# EasyEDA Pro project ProPrj_BeaconOps.epro

# Schematic Schematic
Board Name: Board1; Create Date: 2026-05-24; Page Name: P1; Project Name: BeaconOps; Schematic Name: Schematic; Update Date: 2026-05-24
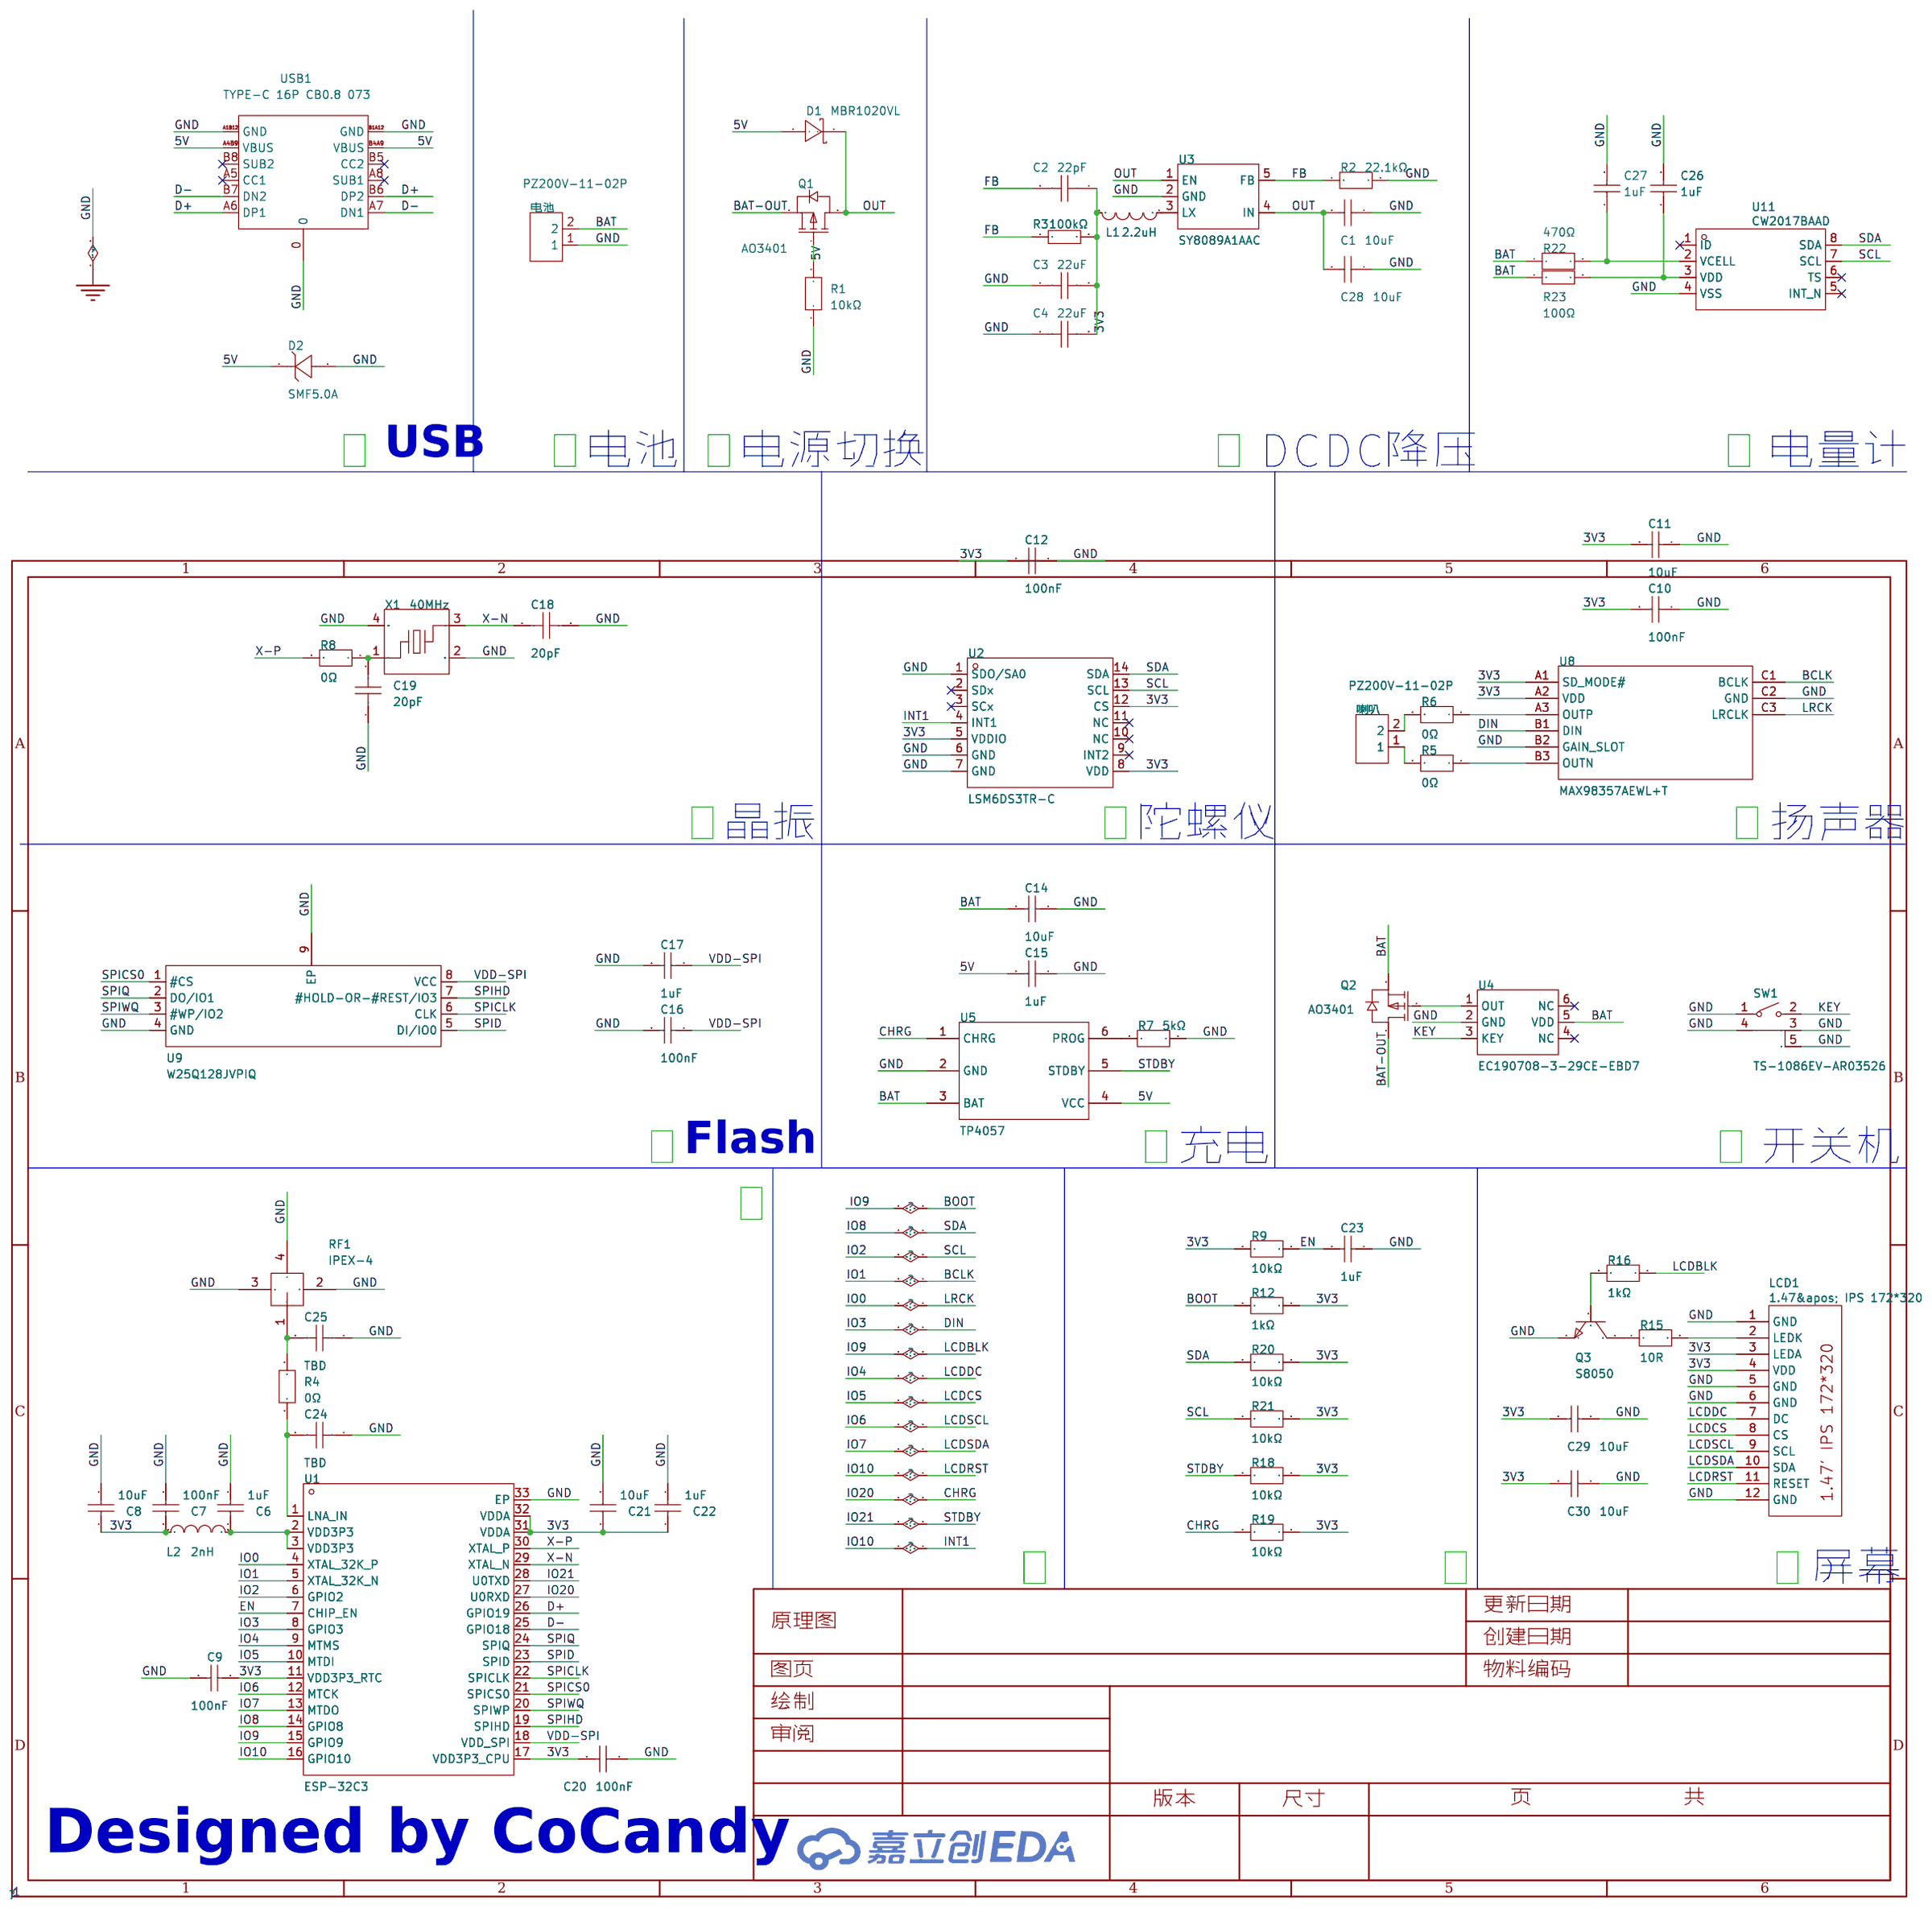
[diagram p0: schematic sheet]

## Parts
C1  10uF  [R0402]
C2  22pF  [R0402]
C3  22uF  [R0402]
C4  22uF  [R0402]
C6  1uF  [R0402]
C7  100nF  [R0402]
C8  10uF  [R0402]
C9  100nF  [R0402]
C10  100nF  [R0402]
C11  10uF  [R0402]
C12  100nF  [R0402]
C14  10uF  [R0402]
C15  1uF  [R0402]
C16  100nF  [R0402]
C17  1uF  [R0402]
C18  20pF  [R0402]
C19  20pF  [R0402]
C20  100nF  [R0402]
C21  10uF  [R0402]
C22  1uF  [R0402]
C23  1uF  [R0402]
C24  20pF  [R0402]
C25  20pF  [R0402]
C26  1uF  [R0402]
C27  1uF  [R0402]
C28  10uF  [R0402]
C29  10uF  [R0402]
C30  10uF  [R0402]
D1  MBR1020VL  [SOD-123F_L2.8-W1.8-LS3.7-RD]
D2  SMF5.0A  [SOD-123FL_L2.7-W1.8-LS3.8-RD]
L1  2.2uH  [IND-SMD_L4.4-W4.2]
L2  2nH  [R0402]
LCD1  1.47&apos; IPS 172*320  [1.47寸 IPS 172*320]
Q1  AO3401  [SOT-23-3_L2.9-W1.4-P1.90-LS2.6-BR]
Q2  AO3401  [SOT-23-3_L2.9-W1.4-P1.90-LS2.6-BR]
Q3  S8050  [SOT-23-3_L2.9-W1.3-P1.90-LS2.4-BR]
R1  10kΩ  [R0402]
R2  22.1kΩ  [R0402]
R3  100kΩ  [R0402]
R4  0Ω  [R0402]
R5  0Ω  [R0402]
R6  0Ω  [R0402]
R7  5kΩ  [R0402]
R8  0Ω  [R0402]
R9  10kΩ  [R0402]
R12  1kΩ  [R0402]
R15  10R  [R0402]
R16  1kΩ  [R0402]
R18  10kΩ  [R0402]
R19  10kΩ  [R0402]
R20  10kΩ  [R0402]
R21  10kΩ  [R0402]
R22  470Ω  [R0402]
R23  100Ω  [R0402]
RF1  IPEX-4  [IPEX-SMD_4P-L1.8-W1.7-LS2.0]
SW1  TS-1086EV-AR03526  [SW-SMD_TS-1086EV-AR03526]
U1  ESP-32C3  [QFN-32_L5.0-W5.0-P0.50-TL-EP3.7]
U2  LSM6DS3TR-C  [LGA-14_L3.0-W2.5-P0.50-TL]
U3  SY8089A1AAC  [TSOT-23-5_L2.9-W1.6-P0.95-LS2.8-BR]
U4  EC190708-3-29CE-EBD7  [SOT-23-6_L2.9-W1.6-P0.95-LS2.9-BL]
U5  TP4057  [SOT-23-6_L2.9-W1.6-P0.95-LS2.8-BR]
U8  MAX98357AEWL+T  [WLP-9_L1.4-W1.3-P0.40-R3-C3-BR]
U9  W25Q128JVPIQ  [WSON-8_L6.0-W5.0-P1.27-BL-EP]
U11  CW2017BAAD  [WDFN-8_L2.0-W2.0-P0.50-BL]
USB1  TYPE-C 16P CB0.8 073  [USB-C-SMD_TYPE-C-16P-CB0.8-073]
X1  40MHz  [CRYSTAL-SMD_4P-L2.0-W1.6-BL-2]
喇叭  PZ200V-11-02P  [HDR-TH_2P-P2.00-V-M]
电池  PZ200V-11-02P  [HDR-TH_2P-P2.00-V-M]

## Library data of the parts
C1 C8 C11 C14 C21 C28-C30 = CL05A106MQ5NUNC: 容值:10uF;精度:±20%;额定电压:6.3V;材质(温度系数):X5R;; LCSC Part Name: 10uF ±20% 6.3V; Supplier Part: C15525; Manufacturer: SAMSUNG(三星); Supplier Footprint: 0402; JLCPCB Part Class: 基础库; Datasheet: https://atta.szlcsc.com/upload/public/pdf/source/20220823/2B02EE04F8F211D38A52DCB16EB6BEBA.pdf; Supplier: LCSC; Tolerance: ±20%; Voltage Rated: 6.3V; Temperature Coefficient: X5R
C2 = RF03N220J250CT: 容值:22pF;精度:±5%;额定电压:25V;材质(温度系数):NP0;; LCSC Part Name: 22pF ±5% 25V; Supplier Part: C304672; Manufacturer: Walsin(华新科); Supplier Footprint: 0201; JLCPCB Part Class: 扩展库; Datasheet: https://atta.szlcsc.com/upload/public/pdf/source/20191217/C469622_E5C675410661E206E30F3A5ADE7C582C.pdf; Supplier: LCSC; Tolerance: ±5%; Voltage Rated: 25V; Temperature Coefficient: NP0
C3 C4 = GRM155R60J226ME11D: 容值:22uF;精度:±20%;额定电压:6.3V;温度系数:X5R;; LCSC Part Name: 22uF ±20% 6.3V; Supplier Part: C415703; Manufacturer: muRata(村田); Supplier Footprint: 0402; JLCPCB Part Class: 扩展库; Datasheet: https://atta.szlcsc.com/upload/public/pdf/source/20200305/C490387_23319AE8C154DEB24C505E6C82A8106A.pdf; Supplier: LCSC; Tolerance: ±20%; Voltage Rating: 6.3V; Temperature Coefficient: X5R
C6 C15 C17 C22 C23 = GRM033R61A105ME44D: 容值:1uF;精度:±20%;额定电压:10V;材质(温度系数):X5R;; LCSC Part Name: 1uF ±20% 10V; Supplier Part: C76935; Manufacturer: muRata(村田); Supplier Footprint: 0201; JLCPCB Part Class: 扩展库; Datasheet: https://atta.szlcsc.com/upload/public/pdf/source/20190904/C426118_85E81C7C1F21FC87C5FB6D536E0847B4.pdf; Supplier: LCSC; Tolerance: ±20%; Voltage Rated: 10V; Temperature Coefficient: X5R
C7 C9 C10 C12 C16 C20 C26 C27 = GRM033R61E104KE14D: 容值:100nF;精度:±10%;额定电压:25V;温度系数:X5R;; LCSC Part Name: 100nF ±10% 25V; Supplier Part: C76939; Manufacturer: muRata(村田); Supplier Footprint: 0201; JLCPCB Part Class: 扩展库; Datasheet: https://atta.szlcsc.com/upload/public/pdf/source/20180307/C76939_15204091018551407727.pdf; Supplier: LCSC; Tolerance: ±10%; Voltage Rating: 25V; Temperature Coefficient: X5R
C18 C19 C24 C25 = CGA0201C0G200J500ET: 容值:20pF;精度:±5%;额定电压:50V;温度系数:C0G;; LCSC Part Name: 20pF ±5% 50V; Supplier Part: C22435933; Manufacturer: HRE(芯声); Supplier Footprint: 0201; JLCPCB Part Class: 扩展库; Datasheet: https://atta.szlcsc.com/upload/public/pdf/source/20240523/E378902E5B8392A09BB57539773628DB.pdf; Supplier: LCSC; Tolerance: ±5%; Voltage Rating: 50V; Temperature Coefficient: C0G
D1 = MBR1020VL: Supplier: LCSC; Supplier Part: C191986; Manufacturer: onsemi(安森美); JLCPCB Part Class: Extended Part
D2 = SMF5.0A_C19077497: 极性:单向;反向截止电压(Vrwm):5V;钳位电压:9.2V;峰值脉冲电流(Ipp):21.7A@10/1000us;峰值脉冲功率(Ppp):200W@10/1000us;击穿电压:7V;; LCSC Part Name: 单向TVS 5V截止 峰值浪涌电流：21.7A@10/1000us; Supplier Part: C19077497; Manufacturer: R+O(宏嘉诚); Supplier Footprint: SOD-123FL; JLCPCB Part Class: 扩展库; Datasheet: https://item.szlcsc.com/datasheet/SMF5.0A/20275582.html; Supplier: LCSC; Polarity: 单向; Reverse Stand-Off Voltage (Vrwm): 5V; Clamping Voltage: 9.2V; Peak Pulse Current (Ipp): 21.7A@10/1000us; Peak Pulse Power Dissipation (Ppp): 200W@10/1000us; Voltage - Breakdown: 7V; Reverse Leakage Current (Ir): 400uA; Number of Channels: 单路; Operating Temperature: -55℃~+150℃; level of protection: IEC 61000-4-2; Type: TVS
L1 = FXL0420-2R2-M: 电感值:2.2uH;精度:±20%;额定电流:4.5A;饱和电流(Isat):5A;类型:一体成型电感;; LCSC Part Name: 2.2uH ±20% 5A; Supplier Part: C167206; Manufacturer: cjiang(长江微电); Supplier Footprint: SMD,4.2x4.4mm; JLCPCB Part Class: 扩展库; Datasheet: https://atta.szlcsc.com/upload/public/pdf/source/20240426/3189EA8206330E2108542F9E34E540E7.pdf; Supplier: LCSC; Tolerance: ±20%; Rated Current: 4.5A; Saturation Current (Isat): 5A; DC Resistance (DCR): 58mΩ; Type: 一体成型电感
L2 = LQP03TN2N0B02D: 电感值:2nH;精度:-;额定电流:600mA;饱和电流(Isat):-;直流电阻(DCR):150mΩ;; LCSC Part Name: 2nH ±0.1nH; Supplier Part: C86125; Manufacturer: muRata(村田); Supplier Footprint: 0201; JLCPCB Part Class: 扩展库; Datasheet: https://atta.szlcsc.com/upload/public/pdf/source/20200107/C157592_7FF58F85BAEF0D918ADFA12AEC0AEBA8.pdf; Supplier: LCSC; Rated Current: 600mA; DC Resistance (DCR): 150mΩ; Q @ Freq: 14@500MHz; Frequency - Self Resonant: 12.5GHz
LCD1 = 1.47' IPS 172*320
Q1 Q2 = AO3401_C727156: 类型:1个P沟道;漏源电压(Vdss):30V;连续漏极电流(Id):4.2A;导通电阻(RDS(on)@Vgs,Id):65mΩ@10V,4.2A;功率:350mW;阈值电压(Vgs(th)@Id):1.3V@250uA;; LCSC Part Name: 1个P沟道 耐压:30V 电流:4.2A; Supplier Part: C727156; Manufacturer: TWGMC(台湾迪嘉); Supplier Footprint: SOT-23; JLCPCB Part Class: 扩展库; Datasheet: https://atta.szlcsc.com/upload/public/pdf/source/20200827/C727156_6E081BBEEFBC6B8FEE164CB196B0AF30.pdf; Supplier: LCSC; Type: 1个P沟道; Drain Source Voltage (Vdss): 30V; Continuous Drain Current (Id): 4.2A; Drain Source On Resistance (RDS(on)@Vgs,Id): 65mΩ@10V,4.2A; Power Dissipation (Pd): 350mW; Gate Threshold Voltage (Vgs(th)@Id): 1.3V@250uA; Input Capacitance (Ciss@Vds): 954pF; Reverse Transfer Capacitance (Crss@Vds): 77pF; Operating Temperature: -55℃~+150℃
Q3 = S8050_C2891804: 晶体管类型:NPN;集电极电流(Ic):500mA;集射极击穿电压(Vceo):25V;耗散功率(Pd):300mW;直流电流增益(hFE):400@50mA,1V;; Supplier Part: C2891804; Manufacturer: YONGYUTAI(永裕泰); Supplier Footprint: SOT-23; JLCPCB Part Class: 扩展库; Datasheet: https://atta.szlcsc.com/upload/public/pdf/source/20210901/5347316A10609C628D4D69AE01446E5B.pdf; Supplier: LCSC; type: NPN; Current - Collector(Ic): 500mA; Collector - Emitter Voltage VCEO: 25V; Pd - Power Dissipation: 300mW; DC Current Gain: 400@50mA,1V; Current - Collector Cutoff: 1uA; Vce Saturation(VCE(sat)): 500mV
R1 R9 R12 R16 R18-R21 = 0201WMF1002TEE: 电阻类型:厚膜电阻;阻值:10kΩ;精度:±1%;功率:50mW;最大工作电压:25V;温度系数:±200ppm/℃;; LCSC Part Name: 10kΩ ±1% 50mW 厚膜电阻; Supplier Part: C473048; Manufacturer: UNI-ROYAL(厚声); Supplier Footprint: 0201; JLCPCB Part Class: 扩展库; Datasheet: https://atta.szlcsc.com/upload/public/pdf/source/20200306/C422600_1E6D84923E4A46A82E41ADD87F860B5C.pdf; Supplier: LCSC; Type: 厚膜电阻; Tolerance: ±1%; Power(Watts): 50mW; Overload Voltage (Max): 25V; Temperature Coefficient: ±200ppm/℃; Operating Temperature Range: -55℃~+155℃
R2 = 0201WMF2212TEE: 电阻类型:厚膜电阻;阻值:22.1kΩ;精度:±1%;功率:50mW;最大工作电压:25V;温度系数:±200ppm/℃;; LCSC Part Name: 22.1kΩ ±1% 50mW 厚膜电阻; Supplier Part: C423662; Manufacturer: UNI-ROYAL(厚声); Supplier Footprint: 0201; JLCPCB Part Class: 扩展库; Datasheet: https://atta.szlcsc.com/upload/public/pdf/source/20200306/C422600_1E6D84923E4A46A82E41ADD87F860B5C.pdf; Supplier: LCSC; Type: 厚膜电阻; Tolerance: ±1%; Power(Watts): 50mW; Overload Voltage (Max): 25V; Temperature Coefficient: ±200ppm/℃; Operating Temperature Range: -55℃~+155℃
R3 = 0201WMF1003TEE: 电阻类型:厚膜电阻;阻值:100kΩ;精度:±1%;功率:50mW;最大工作电压:25V;温度系数:±200ppm/℃;; LCSC Part Name: 100kΩ ±1% 50mW 厚膜电阻; Supplier Part: C270364; Manufacturer: UNI-ROYAL(厚声); Supplier Footprint: 0201; JLCPCB Part Class: 扩展库; Datasheet: https://atta.szlcsc.com/upload/public/pdf/source/20200306/C422600_1E6D84923E4A46A82E41ADD87F860B5C.pdf; Supplier: LCSC; Type: 厚膜电阻; Tolerance: ±1%; Power(Watts): 50mW; Overload Voltage (Max): 25V; Temperature Coefficient: ±200ppm/℃; Operating Temperature Range: -55℃~+155℃
R4-R6 R8 = 0201WMF0000TEE: 电阻类型:厚膜电阻;阻值:0Ω;精度:±1%;功率:50mW;最大工作电压:25V;; LCSC Part Name: 0Ω ±1% 50mW 厚膜电阻; Supplier Part: C473473; Manufacturer: UNI-ROYAL(厚声); Supplier Footprint: 0201; JLCPCB Part Class: 扩展库; Datasheet: https://atta.szlcsc.com/upload/public/pdf/source/20200306/C422600_1E6D84923E4A46A82E41ADD87F860B5C.pdf; Supplier: LCSC; Type: 厚膜电阻; Tolerance: ±1%; Power(Watts): 50mW; Overload Voltage (Max): 25V; Operating Temperature Range: -55℃~+155℃
R7 = TNPW02015K00BEED: 电阻类型:薄膜电阻;阻值:5kΩ;精度:±0.1%;功率:75mW;工作电压:25V;温度系数:±25ppm/℃;; LCSC Part Name: 薄膜电阻 5kΩ ±0.1% 75mW; Supplier Part: C1857713; Manufacturer: VISHAY(威世); Supplier Footprint: 0201; JLCPCB Part Class: 扩展库; Datasheet: https://atta.szlcsc.com/upload/public/pdf/source/20210611/7E5076F8AE36443BBEA8C2F8BE3882EA.pdf; Supplier: LCSC; Type: 薄膜电阻; Tolerance: ±0.1%; Power(Watts): 75mW; Voltage-Supply(Max): 25V; Temperature Coefficient: ±25ppm/℃; Operating Temperature: -55℃~+155℃
R15 = RC0201FR-071RL: 电阻类型:厚膜电阻;阻值:1Ω;精度:±1%;功率:50mW;最大工作电压:25V;温度系数:-100ppm/℃~+350ppm/℃;; LCSC Part Name: 厚膜电阻 1Ω ±1% 50mW; Supplier Part: C469665; Manufacturer: YAGEO(国巨); Supplier Footprint: 0201; JLCPCB Part Class: 扩展库; Datasheet: https://atta.szlcsc.com/upload/public/pdf/source/20181031/C326976_E9901E35333D136A19B6CE377E889A82.pdf; Supplier: LCSC; Type: 厚膜电阻; Tolerance: ±1%; Power(Watts): 50mW; Overload Voltage (Max): 25V; Temperature Coefficient: -100ppm/℃~+350ppm/℃; Operating Temperature Range: -55℃~+125℃
R22 = AC0402FR-07470RL: 电阻类型:厚膜电阻;阻值:470Ω;精度:±1%;功率:62.5mW;温度系数:±100ppm/℃;最大工作电压:50V;工作温度范围:-55℃~+155℃;; LCSC Part Name: 470Ω ±1% 62.5mW; Supplier Part: C227095; Manufacturer: YAGEO(国巨); Supplier Footprint: 0402; JLCPCB Part Class: Extended Part; Datasheet: https://atta.szlcsc.comnull; Supplier: LCSC; Type: 厚膜电阻; Tolerance: ±1%; Power(Watts): 62.5mW; Temperature Coefficient: ±100ppm/℃; Overload Voltage (Max): 50V; Operating Temperature Range: -55℃~+155℃
R23 = RC0402FR-07100RL: 电阻类型:厚膜电阻;阻值:100Ω;精度:±1%;功率:62.5mW;温度系数:±100ppm/℃;最大工作电压:50V;工作温度范围:-55℃~+155℃;; LCSC Part Name: 100Ω ±1% 62.5mW; Supplier Part: C106232; Manufacturer: YAGEO(国巨); Supplier Footprint: 0402; JLCPCB Part Class: Extended Part; Datasheet: https://atta.szlcsc.com/upload/public/pdf/source/20170518/1495085712869.pdf; Supplier: LCSC; Type: 厚膜电阻; Tolerance: ±1%; Power(Watts): 62.5mW; Temperature Coefficient: ±100ppm/℃; Overload Voltage (Max): 50V; Operating Temperature Range: -55℃~+155℃
RF1 = IPEX-4: 射频系列:IPEX;; LCSC Part Name: IPEX; Supplier Part: C2987683; Manufacturer: Ziisor(致哲); Supplier Footprint: SMD; JLCPCB Part Class: 扩展库; Supplier: LCSC; RF Series: IPEX
SW1 = TS-1086EV-AR03526: 电路结构:单刀单掷;按钮形状:矩形按钮;作用力:260gf;安装方式:卧贴;开关长度:4.6mm;开关宽度:1.82mm;开关高度:3.5mm;触点电流:50mA;额定电压(DC):12V;绝缘电阻:100MΩ;机械寿命:5万次;; LCSC Part Name: 4.6*1.82*3.5mm 卧贴 轻触开关; Supplier Part: C720474; Manufacturer: XUNPU(讯普); Supplier Footprint: SMD; JLCPCB Part Class: 扩展库; Datasheet: https://atta.szlcsc.com/upload/public/pdf/source/20200810/C720474_FC3C14381FD09EAEAE2D1CD66B8D7DBA.pdf; Supplier: LCSC; Circuit: 单刀单掷; Actuator Style: 矩形按钮; Operating Force: 260gf; Mounting Style: 卧贴; Switch Length: 4.6mm; Switch Width: 1.82mm; Switch Height: 3.5mm; Contact Current: 50mA; Voltage Rating (DC): 12V; Insulation Resistance: 100MΩ; Actuator/Cap Color: 黑色; Pin Style: SMD接片; Mechanical Life: 5万次; Operating Temperature: -30℃~+80℃
U1 = ESP32-C3FH4: Supplier Part: C2858491; Manufacturer: ESPRESSIF(乐鑫); Supplier Footprint: QFN-32-EP(5x5); JLCPCB Part Class: 扩展库; Datasheet: https://atta.szlcsc.com/upload/public/pdf/source/20241030/9E2CC81EADAF965BF8A3CB78FAC4244F.pdf; Supplier: LCSC
U2 = LSM6DS3TR-C: 传感器类型:加速度计陀螺仪;; LCSC Part Name: IMU-惯性测量单元; Supplier Part: C967633; Manufacturer: ST(意法半导体); Supplier Footprint: LGA-14(2.5x3); JLCPCB Part Class: 扩展库; Datasheet: https://atta.szlcsc.com/upload/public/pdf/source/20210226/C967633_4D8B3A108D63359423D57B97CE5134B1.pdf; Supplier: LCSC; Sensor Type: 加速度计陀螺仪; Operating Temperature: -40℃~+85℃
U3 = SY8089A1AAC: 功能类型:降压型;输出类型:-;工作电压:2.5V~5.5V;输出电压:-;输出电流:2A;; LCSC Part Name: 高效1.5MHz 2A同步降压调节器; Supplier Part: C479074; Manufacturer: silergy(矽力杰); Supplier Footprint: SOT-23-5; JLCPCB Part Class: 扩展库; Datasheet: https://atta.szlcsc.com/upload/public/pdf/source/20200117/C479074_09E605B8BDE11DB5A08573B7E6429A0D.pdf; Supplier: LCSC; Function: 降压型; Voltage - Supply: 2.5V~5.5V; Output Current: 2A; Frequency - Switching: 1.5MHz; Operating Temperature: -40℃~+125℃@(TA); Synchronous Rectifier: 是; Number of Outputs: 1; Topology: 降压式; Quiescent Current: 50uA; Switch tube (built-in/external): 内置
U4 = EC190708-3-29CE-EBD7: Supplier Part: C9900183753; Supplier Footprint: SOT23-6; Supplier: LCSC
U5 = TP4057_1: 工作电压:4V~6.5V;最大充电电流:500mA;电池类型:锂离子/聚合物;电池节数:1;; LCSC Part Name: TP4057  600mA线性锂离子电池充电器; Supplier Part: C21713959; Manufacturer: GOODWORK(固得沃克); Supplier Footprint: SOT-23-6; Datasheet: https://atta.szlcsc.com/upload/public/pdf/source/20250226/EA5EDD80E64A7130958AD475CD86412D.pdf; Supplier: LCSC; Voltage - Supply: 4V~6.5V; Charge Current - Max: 500mA; Type of Battery: 锂离子/聚合物; Number of Cells: 1; Operating Temperature: -40℃~+85℃
U8 = MAX98357AEWL+T: 功放类型:-;扬声器通道数:单声道；双声道;输出功率:-;静态电流(Iq):-;; LCSC Part Name: 微型、低成本、PCM 类 D 级放大器具有 AB 级性能; Supplier Part: C2682619; Manufacturer: ADI(亚德诺)/MAXIM(美信); Supplier Footprint: BGA-9(1.3x1.3); JLCPCB Part Class: 扩展库; Datasheet: https://atta.szlcsc.com/upload/public/pdf/source/20210106/C2682619_15CCD654F2C559A2FC5FDCA8EA0D4E6D.pdf; Supplier: LCSC; Speaker Channels: 单声道；双声道; Voltage - Supply: 2.5V~5.5V; Operating Temperature: -40℃~+85℃
U9 = W25Q128JVPIQ_C190862: 接口类型:SPI;存储容量:-;时钟频率(fc):133MHz;; Supplier Part: C190862; Manufacturer: Winbond(华邦); Supplier Footprint: WSON-8-EP(5x6); JLCPCB Part Class: 扩展库; Datasheet: https://atta.szlcsc.com/upload/public/pdf/source/20190705/C401662_06B6D416F67ED315879B366F63A3F7C9.pdf; Supplier: LCSC; Interface: SPI; Clock Frequency: 133MHz; Voltage - Supply: 2.7V~3.6V; Program / Erase Cycles: 100000次; Block Erase Time(tBE): 120ms@(32KB); Data Retention - TDR (Year): 20年
U11 = CW2017BAAD: Supplier: LCSC; Supplier Part: C2688806; JLCPCB Part Class: Extended Part; Manufacturer: null
USB1 = TYPE-C 16P CB0.8 073: 连接器类型:Type-C;标准:USB 3.1;公母:母;安装方式:沉板;触点数量:16P;端口数量:1;额定电流 - 电源:3A;工作温度范围:-25℃~+85℃;; LCSC Part Name: Type-C 母 沉板; Supplier Part: C2906289; Manufacturer: SHOU HAN(首韩); Supplier Footprint: SMD; JLCPCB Part Class: 扩展库; Datasheet: https://atta.szlcsc.com/upload/public/pdf/source/20211019/7FB277F3E208FF6FA6B4F1FC2FE8DDC1.pdf; Supplier: LCSC; Connector Type: Type-C; Standard: USB 3.1; Gender: 母; Mounting Style: 沉板; Number of Contacts: 16P; Number of Ports: 1; Current Rating - Power (Max): 3A; Operating Temperature Range: -25℃~+85℃; Rated Voltage (Max): 5V; Connect-Disconnect Life: 5千次; Core Colour: 黑色
X1 = T201640MFBDE2X: 频率:40MHz;常温频差:±10ppm;负载电容:12pF;; LCSC Part Name: 40MHz ±10ppm 12pF; Supplier Part: C20885029; Manufacturer: YJX(雅晶鑫); Supplier Footprint: SMD2016-4P; JLCPCB Part Class: 扩展库; Datasheet: https://atta.szlcsc.com/upload/public/pdf/source/20240301/69B1A2250A2F911AB14AAD6A982488C4.pdf; Supplier: LCSC; Normal temperature Frequency Tolerance: ±10ppm; Load Capacitance: 12pF; Operating Temperature: -30℃~+85℃
喇叭 电池 = PZ200V-11-02P: 插针结构:1x2P;间距:2mm;行距:-;圆针/方针:方针;安装方式:直插;排数:单排;总PIN位数:2P;额定电流:-;额定电压:-;配合针长度:3.9mm;塑高:2mm;端接针长度:2.8mm;触头材质:黄铜;触头镀层:-;工作温度:-40℃~+105℃;颜色:黑色;; LCSC Part Name: 1x2P 间距:2mm 方针 直插; Supplier Part: C541856; Manufacturer: XFCN(兴飞); Supplier Footprint: 插件,P=2mm; JLCPCB Part Class: 扩展库; Datasheet: https://atta.szlcsc.com/upload/public/pdf/source/20200518/C541858_7610F54454E936EFCDE06B655DF7C837.pdf; Supplier: LCSC; Pin Structure: 1x2P; Pitch: 2mm; Circluar Pins/Square Pins: 方针; Mounting Type: 直插; Number of Rows: 单排; Number of Pins: 2P; Length of Mating Pin: 3.9mm; Insulation Height: 2mm; Length of End Connection Pin: 2.8mm; Contact Material: 黄铜; Operating Temperature: -40℃~+105℃; Color: 黑色

## Nets
3V3: C2.1 C3.2 C4.2 C7.1 C8.1 C9.1 C10.2 C11.2 C12.2 C20.2 C21.1 C22.1 C29.2 C30.2 L1.2 L2.1 LCD1.3(LEDA) LCD1.4(VDD) R3.2 R9.2 R12.1 R18.1 R19.1 R20.1 R21.1 U1.11(VDD3P3_RTC) U1.17(VDD3P3_CPU) U1.31(VDDA) U1.32(VDDA) U2.5(VDDIO) U2.8(VDD) U2.12(CS) U8.A1(SD_MODE#) U8.A2(VDD)
5V: C15.2 D1.2(A) D2.1(K) Q1.1(G) R1.2 U5.4(VCC) USB1.A4B9(VBUS) USB1.B4A9(VBUS)
GND: C1.1 C3.1 C4.1 C6.2 C7.2 C8.2 C9.2 C10.1 C11.1 C12.1 C14.1 C15.1 C16.2 C17.2 C18.2 C19.1 C20.1 C21.2 C22.2 C23.1 C24.1 C25.1 C26.2 C27.2 C28.1 C29.1 C30.1 D2.2(A) LCD1.1(GND) LCD1.5(GND) LCD1.6(GND) LCD1.12(GND) Q3.2(E) R1.1 R2.2 R7.2 RF1.2 RF1.3 RF1.4 SW1.1 SW1.3 SW1.4 SW1.5 U1.33(EP) U2.1(SDO/SA0) U2.6(GND) U2.7(GND) U3.2(GND) U4.2(GND) U5.2(GND) U8.B2(GAIN_SLOT) U8.C2(GND) U9.4(GND) U9.9(EP) U11.4(VSS) USB1.0 USB1.A1B12(GND) USB1.B1A12(GND) X1.2(GND) X1.4(GND) 电池.1
VDD-SPI: C16.1 C17.1 U1.18(VDD_SPI) U9.8(VCC)
BAT: C14.2 Q2.2(S) R22.1 R23.1 U4.5(VDD) U5.3(BAT) 电池.2
BAT-OUT: Q1.2(S) Q2.3(D)
BCLK: U1.5(XTAL_32K_N) U8.C1(BCLK)
BOOT: R12.2 R16.1 U1.15(GPIO9)
CHRG: R19.2 U1.27(U0RXD) U5.1(CHRG)
D+: U1.26(GPIO19) USB1.A6(DP1) USB1.B6(DP2)
D-: U1.25(GPIO18) USB1.A7(DN1) USB1.B7(DN2)
DIN: U1.8(GPIO3) U8.B1(DIN)
EN: C23.2 R9.1 U1.7(CHIP_EN)
FB: C2.2 R2.1 R3.1 U3.5(FB)
INT1: LCD1.11(RESET) U1.16(GPIO10) U2.4(INT1)
IO0: U1.4(XTAL_32K_P) U8.C3(LRCLK)
IO2: R21.2 U1.6(GPIO2) U2.13(SCL) U11.7(SCL)
IO4: LCD1.7(DC) U1.9(MTMS)
IO5: LCD1.8(CS) U1.10(MTDI)
IO6: LCD1.9(SCL) U1.12(MTCK)
IO7: LCD1.10(SDA) U1.13(MTDO)
IO8: R20.2 U1.14(GPIO8) U2.14(SDA) U11.8(SDA)
IO21: R18.2 U1.28(U0TXD) U5.5(STDBY)
KEY: SW1.2 U4.3(KEY)
OUT: C1.2 C28.2 D1.1(K) Q1.3(D) U3.1(EN) U3.4(IN)
SPICLK: U1.22(SPICLK) U9.6(CLK)
SPICS0: U1.21(SPICS0) U9.1(#CS)
SPID: U1.23(SPID) U9.5(DI/IO0)
SPIHD: U1.19(SPIHD) U9.7(#HOLD-OR-#REST/IO3)
SPIQ: U1.24(SPIQ) U9.2(DO/IO1)
SPIWQ: U1.20(SPIWP) U9.3(#WP/IO2)
X-N: C18.1 U1.29(XTAL_N) X1.3
X-P: R8.2 U1.30(XTAL_P)
$1N1912: L1.1 U3.3(LX)
$1N3352: C24.2 R4.1 U1.1(LNA_IN)
$1N3356: C6.1 L2.2 U1.2(VDD3P3) U1.3(VDD3P3)
$1N5412: R5.1 U8.B3(OUTN)
$1N5450: R6.1 U8.A3(OUTP)
$1N6310: R6.2 喇叭.2
$1N6314: R5.2 喇叭.1
$1N6617: R7.1 U5.6(PROG)
$1N6831: Q2.1(G) U4.1(OUT)
$1N8218: C19.2 R8.1 X1.1
$1N8890: C25.2 R4.2 RF1.1
$1N9299: Q3.3(C) R15.1
$1N9303: LCD1.2(LEDK) R15.2
$1N9342: Q3.1(B) R16.2
$1N23263: C27.1 R22.2 U11.2(VCELL)
$1N23275: C26.1 R23.2 U11.3(VDD)

Not connected (* = marked no-connect by the designer): U2 2(SDx)* 3(SCx)* 9(INT2)* 10(NC)* 11(NC)*; U4 4(NC)* 6(NC)*; U11 1(ID)* 5(INT_N)* 6(TS)*; USB1 A5(CC1)* A8(SUB1)* B5(CC2)* B8(SUB2)*

## Notes on the sheet
- ✔
- USB
- ✔
- 电池
- ✔
- 电源切换
- ✔
- DCDC降压
- ✔
- 电量计
- ✔
- 晶振
- ✔
- 陀螺仪
- ✔
- 扬声器
- ✔
- Flash
- ✔
- 充电
- ✔
- 开关机
- ✔
- ✔
- ✔
- ✔
- 屏幕
- Designed by CoCandy

# Board V1.1-latest
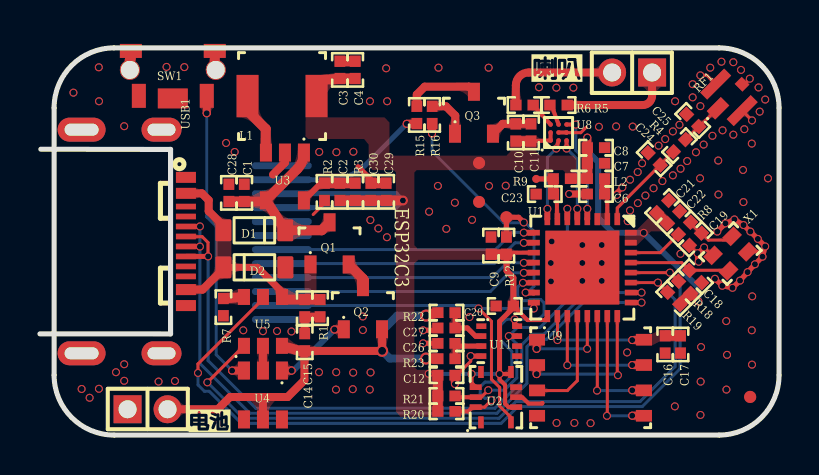
[diagram p1: board, top side]
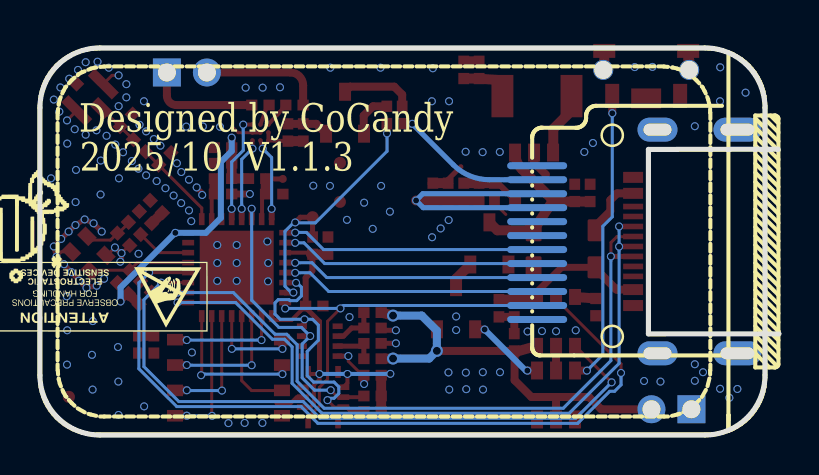
[diagram p2: board, bottom side, seen from below]

Outline 36.99 x 19.39 mm; copper layers: Top Layer, Bottom Layer. Coordinates in mm from the lower left corner of the outline.
Outline path: 0.71,16.39 arc(1.59,18.51) 3.71,19.39 33.99,19.39 arc(36.11,18.51) 36.99,16.39 36.99,3 arc(36.11,0.88) 33.99,0 3.71,0 arc(1.59,0.88) 0.71,3 0.71,16.39
Stack: Top Layer 0.035mm / Dielectric1 0.71mm FR4 er 4.5 / Bottom Layer 0.035mm

## Design rules (mm)
template: 自定义配置
spacing copperThickness1oz (default): track to track 0.102, other pairs 0.1 to 0.3
spacing copperThickness2oz: track to track 0.203, other pairs 0.152 to 0.3
track width copperThickness1oz (default): min 0.127, default 0.254, max 2.54
track width copperThickness2oz: min 0.203, default 0.254, max 2.54
differential pair differentialPair (default): width min 0.127, default 0.254, max 2.54; gap min 0.152, default 0.152
via viaSize (default): diameter min 0.4, default 0.4, max 10; hole min 0.3, default 0.3, max 6.3

## Placement (name value [footprint] x y rotation side)
C1  10uF  [R0402]  10.22 12.13 270 top
C2  22pF  [R0402]  15.01 12.18 90 top
C3  22uF  [R0402]  15.78 18.29 270 top
C4  22uF  [R0402]  15.01 18.29 270 top
C6  1uF  [R0402]  27.82 12.07 180 top
C7  100nF  [R0402]  27.82 13.61 0 top
C8  10uF  [R0402]  27.83 14.39 0 top
C9  100nF  [R0402]  22.57 9.49 90 top
C10  100nF  [R0402]  23.81 15.15 270 top
C11  10uF  [R0402]  24.58 15.15 270 top
C12  100nF  [R0402]  20.34 3 180 top
C14  10uF  [R0402]  13.25 4.65 270 top
C15  1uF  [R0402]  13.25 6.35 90 top
C16  100nF  [R0402]  31.29 4.54 270 top
C17  1uF  [R0402]  32.06 4.54 270 top
C18  20pF  [R0402]  32.81 7.94 315 top
C19  20pF  [R0402]  32.8 9.81 45 top
C20  100nF  [R0402]  23.26 6.46 0 top
C21  10uF  [R0402]  31.16 11.44 45 top
C22  1uF  [R0402]  31.71 10.9 45 top
C23  1uF  [R0402]  25.26 12.07 0 top
C24  20pF  [R0402]  30.74 13.83 315 top
C25  20pF  [R0402]  32.66 15.76 315 top
C26  1uF  [R0402]  20.34 4.59 180 top
C27  1uF  [R0402]  20.34 5.36 180 top
C28  10uF  [R0402]  9.45 12.13 270 top
C29  10uF  [R0402]  17.33 12.18 270 top
C30  10uF  [R0402]  16.56 12.18 270 top
D1  MBR1020VL  [SOD-123F_L2.8-W1.8-LS3.7-RD]  10.73 10.25 180 top
D2  SMF5.0A  [SOD-123FL_L2.7-W1.8-LS3.8-RD]  10.83 8.39 0 top
L1  2.2uH  [IND-SMD_L4.4-W4.2]  12.11 16.98 180 top
L2  2nH  [R0402]  27.82 12.84 0 top
LCD1  1.47&apos; IPS 172*320  [1.47寸 IPS 172*320]  11.75 9.64 180 bottom
NOREF  -  [Pad_e2472]  24.83 12.83 0 top
NOREF#2  -  [Pad_e1315]  23.34 10.91 0 top
NOREF#3  -  [Pad_e3027]  21.97 11.68 0 top
NOREF#4  -  [Pad_e4946]  35.54 1.91 0 top
NOREF#5  -  [Pad_e4944]  21.97 13.63 0 top
Q1  AO3401  [SOT-23-3_L2.9-W1.4-P1.90-LS2.6-BR]  14.49 9.6 270 top
Q2  AO3401  [SOT-23-3_L2.9-W1.4-P1.90-LS2.6-BR]  16.16 6.35 270 top
Q3  S8050  [SOT-23-3_L2.9-W1.3-P1.90-LS2.4-BR]  21.72 16.14 270 top
R1  10kΩ  [R0402]  14.02 6.35 90 top
R2  22.1kΩ  [R0402]  14.24 12.18 270 top
R3  100kΩ  [R0402]  15.78 12.18 270 top
R4  0Ω  [R0402]  32 14.49 45 top
R5  0Ω  [R0402]  25.95 16.53 0 top
R6  0Ω  [R0402]  24.25 16.53 180 top
R7  5kΩ  [R0402]  9.18 6.41 270 top
R8  0Ω  [R0402]  32.25 10.35 225 top
R9  10kΩ  [R0402]  26.12 12.84 0 top
R12  1kΩ  [R0402]  23.34 9.49 90 top
R15  10R  [R0402]  18.86 16.03 270 top
R16  1kΩ  [R0402]  19.63 16.03 90 top
R18  10kΩ  [R0402]  32.26 7.4 135 top
R19  10kΩ  [R0402]  31.72 6.85 135 top
R20  10kΩ  [R0402]  20.34 1.19 0 top
R21  10kΩ  [R0402]  20.34 1.96 0 top
R22  470Ω  [R0402]  20.34 6.13 0 top
R23  100Ω  [R0402]  20.34 3.82 0 top
RF1  IPEX-4  [IPEX-SMD_4P-L1.8-W1.7-LS2.0]  34.53 16.97 315 top
SW1  TS-1086EV-AR03526  [SW-SMD_TS-1086EV-AR03526]  6.65 17.96 180 top
U1  ESP-32C3  [QFN-32_L5.0-W5.0-P0.50-TL-EP3.7]  27.14 8.39 270 top
U2  LSM6DS3TR-C  [LGA-14_L3.0-W2.5-P0.50-TL]  22.82 1.9 90 top
U3  SY8089A1AAC  [TSOT-23-5_L2.9-W1.6-P0.95-LS2.8-BR]  12.26 12.95 90 top
U4  EC190708-3-29CE-EBD7  [SOT-23-6_L2.9-W1.6-P0.95-LS2.9-BL]  11.16 2.01 180 top
U5  TP4057  [SOT-23-6_L2.9-W1.6-P0.95-LS2.8-BR]  11.16 5.69 270 top
U8  MAX98357AEWL+T  [WLP-9_L1.4-W1.3-P0.40-R3-C3-BR]  25.95 15.15 270 top
U9  W25Q128JVPIQ  [WSON-8_L6.0-W5.0-P1.27-BL-EP]  27.56 2.87 270 top
U11  CW2017BAAD  [WDFN-8_L2.0-W2.0-P0.50-BL]  22.98 4.7 270 top
USB1  TYPE-C 16P CB0.8 073  [USB-C-SMD_TYPE-C-16P-CB0.8-073]  4.69 9.7 270 top
X1  40MHz  [CRYSTAL-SMD_4P-L2.0-W1.6-BL-2]  34.55 9.09 225 top
喇叭  PZ200V-11-02P  [HDR-TH_2P-P2.00-V-M]  29.63 18.16 180 top
电池  PZ200V-11-02P  [HDR-TH_2P-P2.00-V-M]  5.38 1.29 0 top

## Footprints (pads in the part's own frame, mm; a bottom-side part is the same pattern mirrored in y, then rotated)
1.47寸 IPS 172*320
  oval 3x0.35 smd: 1(-0.35,3.85) 2(-0.35,3.15) 3(-0.35,2.45) 4(-0.35,1.75) 5(-0.35,1.05) 6(-0.35,0.35) 7(-0.35,-0.349) 8(-0.35,-1.05) 9(-0.35,-1.75) 10(-0.35,-2.45) 11(-0.35,-3.15) 12(-0.35,-3.85)
CRYSTAL-SMD_4P-L2.0-W1.6-BL-2
  rect 0.8x0.6 smd: 1(-0.673,-0.549) 2(0.673,-0.549) 3(0.673,0.549) 4(-0.673,0.549)
HDR-TH_2P-P2.00-V-M
  rect 1.4x1.4 hole 0.9: 1(-1,0)
  round 1.4 hole 0.9: 2(1,0)
IND-SMD_L4.4-W4.2
  rect 1.1x2.12 smd: 1(1.728,0) 2(-1.728,0)
IPEX-SMD_4P-L1.8-W1.7-LS2.0
  rect 0.6x1 smd: 1(0.001,-0.852)
  rect 0.5x1.7 smd: 2(0.94,-0.077) 4(-0.94,-0.077)
  rect 0.55x0.5 smd: 3(0.001,0.852)
LGA-14_L3.0-W2.5-P0.50-TL
  rect 0.6x0.28 smd: 1(-1.262,0.75) 4(-1.262,-0.75) 8(1.262,-0.75) 11(1.262,0.75)
  rect 0.28x0.6 smd: 5(-0.5,-1.012) 6(0,-1.012) 7(0.5,-1.012) 12(0.5,1.012) 13(0,1.012) 14(-0.5,1.012)
Pad_e1315
  round 0.61 smd: TP1(0,0)
Pad_e2472
  round 0.4 smd: TP2(0,0)
Pad_e3027
  round 0.6 smd: TP3(0,0)
Pad_e4944
  round 0.61 smd: TP1(0,0)
Pad_e4946
  round 0.61 smd: TP2(0,0)
QFN-32_L5.0-W5.0-P0.50-TL-EP3.7
  rect 0.6x0.28 smd: 1(-2.428,1.75) 2(-2.428,1.25) 3(-2.428,0.75) 4(-2.428,0.25) 5(-2.428,-0.25) 6(-2.428,-0.75) 7(-2.428,-1.25) 8(-2.428,-1.75) 17(2.428,-1.75) 18(2.428,-1.25) 19(2.428,-0.75) 20(2.428,-0.25) 21(2.428,0.25) 22(2.428,0.75) 23(2.428,1.25) 24(2.428,1.75)
  rect 0.28x0.6 smd: 9(-1.75,-2.428) 10(-1.25,-2.428) 11(-0.75,-2.428) 12(-0.25,-2.428) 13(0.25,-2.428) 14(0.75,-2.428) 15(1.25,-2.428) 16(1.75,-2.428) 25(1.75,2.428) 26(1.25,2.428) 27(0.75,2.428) 28(0.25,2.428) 29(-0.25,2.428) 30(-0.75,2.428) 31(-1.25,2.428) 32(-1.75,2.428)
  rect 3.7x3.7 smd: 33(0,0)
R0402
  rect 0.566x0.54 smd: 1(-0.433,0) 2(0.433,0)
SOD-123F_L2.8-W1.8-LS3.7-RD
  rrect 0.8x1.1 smd: 1(-1.55,0) 2(1.55,0)
SOD-123FL_L2.7-W1.8-LS3.8-RD
  rrect 0.8x1.1 smd: 1(-1.647,0.013) 2(1.452,0.013)
SOT-23-3_L2.9-W1.3-P1.90-LS2.4-BR
  rect 0.9x0.6 smd: 1(1.05,-0.95) 2(1.05,0.95) 3(-1.05,0)
SOT-23-3_L2.9-W1.4-P1.90-LS2.6-BR
  rect 0.9x0.6 smd: 1(1.055,-0.955) 2(1.055,0.955) 3(-1.055,0)
SOT-23-6_L2.9-W1.6-P0.95-LS2.8-BR
  rect 0.8x0.6 smd: 1(1.225,-0.95) 2(1.225,0) 3(1.225,0.95) 4(-1.224,0.95) 5(-1.224,0) 6(-1.224,-0.95)
SOT-23-6_L2.9-W1.6-P0.95-LS2.9-BL
  rect 0.6x0.9 smd: 1(-0.95,-1.226) 2(0,-1.226) 3(0.95,-1.226) 4(0.95,1.226) 5(0,1.226) 6(-0.95,1.226)
SW-SMD_TS-1086EV-AR03526
  rect 0.7x1.2 smd: 1(1.7,0.975) 2(-1.7,0.975)
  rect 1.5x1 smd: 3(0,1.105)
  round 1 hole 0.9: 4(-2.15,-0.325) 5(2.15,-0.325)
  rect 1.1x0.7 smd: 4(-2.1,-1.275) 5(2.1,-1.275)
TSOT-23-5_L2.9-W1.6-P0.95-LS2.8-BR
  rect 0.9x0.6 smd: 1(1.194,-0.951) 2(1.194,-0.001) 3(1.194,0.951) 4(-1.194,0.951) 5(-1.194,-0.949)
USB-C-SMD_TYPE-C-16P-CB0.8-073
  oval 1.2x2 hole 0.6x1.4: 0(-5.6,1.389) 0(5.6,1.389)
  oval 1.2x2.4 hole 0.6x1.7: 0(-5.6,-2.611) 0(5.6,-2.611)
  rect 0.55x1 smd: A1B12(-3.21,2.611) A4B9(-2.41,2.611) B1A12(3.21,2.611) B4A9(2.41,2.611)
  rect 0.28x1 smd: A5(-1.25,2.611) A6(-0.25,2.611) A7(0.251,2.61) A8(1.25,2.611) B5(1.75,2.611) B6(0.75,2.611) B7(-0.75,2.61) B8(-1.75,2.611)
WDFN-8_L2.0-W2.0-P0.50-BL
  rect 0.28x0.5 smd: 1(-0.75,-0.894) 2(-0.25,-0.894) 3(0.25,-0.894) 4(0.75,-0.894) 5(0.75,0.894) 6(0.25,0.894) 7(-0.25,0.894) 8(-0.75,0.894)
WLP-9_L1.4-W1.3-P0.40-R3-C3-BR
  round 0.23 smd: A1(0.4,-0.4) A2(0,-0.4) A3(-0.4,-0.4) B1(0.4,0) B2(0,0) B3(-0.4,0) C1(0.4,0.4) C2(0,0.4) C3(-0.4,0.4)
WSON-8_L6.0-W5.0-P1.27-BL-EP
  rect 0.581x0.8 smd: 1(-1.905,-2.683) 2(-0.635,-2.683) 3(0.635,-2.683) 4(1.905,-2.683) 5(1.905,2.67) 6(0.635,2.67) 7(-0.635,2.67) 8(-1.905,2.67)

## Nets
As in the schematic, except:
3V3: C2.1 C3.2 C4.2 C7.1 C8.1 C9.1 C10.2 C11.2 C12.2 C20.2 C21.1 C22.1 C29.2 C30.2 L1.2 L2.1 LCD1.3 LCD1.4 NOREF#5.TP1 R3.2 R9.2 R12.1 R18.1 R19.1 R20.1 R21.1 U1.11 U1.17 U1.31 U1.32 U2.5 U2.8 U2.12 U8.A1 U8.A2
GND: C1.1 C3.1 C4.1 C6.2 C7.2 C8.2 C9.2 C10.1 C11.1 C12.1 C14.1 C15.1 C16.2 C17.2 C18.2 C19.1 C20.1 C21.2 C22.2 C23.1 C24.1 C25.1 C26.2 C27.2 C28.1 C29.1 C30.1 D2.2 LCD1.1 LCD1.5 LCD1.6 LCD1.12 NOREF#3.TP3 NOREF#4.TP2 Q3.2 R1.1 R2.2 R7.2 RF1.2 RF1.3 RF1.4 SW1.1 SW1.3 SW1.4 SW1.5 U1.33 U2.1 U2.6 U2.7 U3.2 U4.2 U5.2 U8.B2 U8.C2 U9.4 U11.4 USB1.0 USB1.A1B12 USB1.B1A12 X1.2 X1.4 电池.1
BOOT: NOREF#2.TP1 R12.2 R16.1 U1.15
EN: C23.2 NOREF.TP2 R9.1 U1.7

Pads without a net: U2 11; U4 4 6; U11 1 5 6; USB1 A5 A8 B5 B8

## Via types
v1: diameter 0.4, hole 0.3, Top Layer to Bottom Layer, 199 vias
v2: diameter 0.6, hole 0.4, Top Layer to Bottom Layer, 3 vias

## Routing (per net, layer and track width the routed paths; a pad name or vN(x,y) marks a point on that pad's centre or on a via; arc(x,y) is an arc through that point)
3V3: length 56
  Top Layer w0.2: v1(19.45,3.07) 19.84,3.07 19.91,3 ; U1.11 23.51,9.14 23.43,9.05 ; U2.5 23.45,1.4 23.28,1.57 23.28,2.5 23,2.78 v1(23,3.06) 23.47,3.06 U2.8 ; U1.17 25.39,5.9 25.25,5.76 24.4,5.76 C20.2 ; U8.A2 U8.A1 C11.2 ; v1(21.6,3.06) 21.6,2.61 U2.12
  Top Layer w0.25: C20.2 23.69,6.38 23,5.69 v1(23,3.06)
  Top Layer w0.3: 23.43,9.05 23.35,8.98 23.35,8.22 23.69,7.88 C20.2 ; v1(32.95,6.69) 32.57,7.07 R18.1
  Top Layer w0.4: C8.1 27.39,14.89
  Top Layer w0.5: C4.2 C3.2 ; R9.2 L2.1 ; 14.02,17.78 15,17.85 ; 32.57,7.09 32.02,6.54 ; 22.66,9.05 23.43,9.05 ; 19.91,1.19 19.91,3 ; C8.1 27.39,12.84 ; 30.86,11.14 C22.1 ; C2.1 R3.2 C30.2 C29.2 17.33,11.75 v1(18.17,11.75) ; C10.2 C11.2
  Bottom Layer w0.2: v1(19.45,3.07) 19.46,3.06 v1(21.6,3.06) 23,3.06 v1(23,3.06)
  Bottom Layer w0.254: 12.1,12.09 17.82,12.09 v1(18.17,11.75) 17.81,11.39 LCD1.4
  Bottom Layer w0.3: v1(32.95,6.69) 32.95,7.39 v1(30.22,10.13) 28.69,10.13 27.94,10.88 27.94,13.68 27.39,14.22 v1(27.39,14.9)
5V: length 11.1
  Top Layer w0.35: D2.1 10.88,8.4 12.11,7.17 U5.4
  Top Layer w0.4: USB1.A4B9 8.1,12.11 8.44,11.76 8.44,11.21 9.18,10.48 D1.2 ; USB1.B4A9 8.14,7.28 9.18,8.33 D2.1
  Top Layer w0.5: R1.2 C15.2 12.24,6.79 U5.4
GND: length 31.1
  Top Layer w0.15: v1(33.24,9.4) 33.63,9 X1.2 ; v1(35.63,15.76) RF1.2 ; v1(35.52,17.85) 35.25,17.57 35.14,17.57 ; v1(21.55,3.96) 21.55,3.7 20.85,3 20.78,3 ; v1(33.05,18.01) 33.38,18.01 RF1.4 ; R2.2 14.24,11.61 13.67,11.05 ; X1.4 35.91,9.18 v1(36.16,8.93) ; 27.33,15.41 27.07,15.14 26.36,15.14 U8.C2 ; C19.1 32.52,9.5 v1(32.91,9.11)
  Top Layer w0.2: 25.14,1.61 25.14,1.6 25.12,1.58 24.45,1.58 24.14,1.89 23.84,1.89 U2.6 ; U8.B2 U8.C2
  Top Layer w0.25: v1(19.17,4.6) 19.91,4.6 19.91,4.59 ; v1(19.17,5.25) 19.8,5.25 19.91,5.36 ; U11.4 21.56,3.95 v1(21.55,3.96)
  Top Layer w0.254: v1(28.87,12.02) 28.87,12.13 v1(29.14,12.4) ; 15.92,13.44 16.56,12.8 C30.1 ; v1(33.24,9.4) 32.95,9.11 v1(32.91,9.11) 32.91,8.74 v1(32.97,8.68) ; v1(33.78,7.83) v1(34.15,7.48) v1(34.66,7.37) v1(35.04,7.74) v1(35.42,8.16) v1(35.78,8.55) v1(36.16,8.93) v1(36.3,9.45) v1(35.93,9.82) v1(35.55,10.19) v1(35.21,10.52) v1(34.75,10.8) v1(34.3,10.6) 34.3,10.6 v1(33.9,10.19)
  Top Layer w0.35: v1(26.48,12.07) C6.2
  Top Layer w0.4: Q3.2 23.16,15.59 C10.1 24.58,15.59 ; 20.77,2.58 20.77,2.99 20.78,3 ; R1.1 C15.1 13.25,5.08 ; 11.66,13.05 12.26,13.64 U3.2 ; U5.2 U4.2
  Top Layer w0.5: 4.55,18.84 4.5,18.79 SW1.5 ; 8.75,18.84 8.75,18.34 SW1.4 ; 15.01,18.72 15.78,18.72 ; C30.1 C29.1
  vias: v1(1.67,17.15) v1(2.08,2.31) v1(2.48,1.87) v1(2.94,18.42) v1(2.95,16.72) v1(2.95,2.32) v1(3.8,3.15) v1(4.22,15.47) v1(4.22,3.55) v1(4.22,2.72) v1(5.94,2.68) v1(6.33,18.44) v1(6.75,2.71) v1(7.22,18.43) v1(9.31,14.63) v1(9.74,14.18) v1(10.17,5.25) v1(11.16,5.2) v1(11.86,5.21) v1(12.58,5.19) v1(13.97,14.18) v1(13.97,3.15) v1(14.83,14.17) v1(14.82,3.15) v1(14.81,2.28) v1(15.69,14.19) v1(15.67,3.13) v1(15.66,2.3) v1(16.16,5.94) v1(16.16,5.26) v1(16.51,16.72) v1(16.53,10.77) v1(16.54,3.14) v1(16.5,2.28) v1(16.94,10.35) v1(17.32,18.37) v1(17.38,16.72) v1(17.36,9.91) v1(19.47,11.19) v1(19.94,18.4) v1(19.91,12.48) v1(20.33,10.33) v1(20.76,11.64) v1(20.77,2.56) v1(21.5,5.91) v1(21.62,10.78) v1(22.45,18.4) v1(22.47,12.48) v1(23.31,12.49) v1(24.97,17.42) v1(25.56,8.62) v1(25.57,7.7) v1(25.61,9.7) v1(25.84,17.4) v1(25.85,0.61) v1(26.69,17.4) v1(26.74,0.61) v1(27.14,9.52) v1(27.14,8.62) v1(27.14,7.72) v1(27.56,0.6) v1(27.97,15.44) v1(28.11,9.52) v1(28.12,8.62) v1(28.12,7.72) v1(28.83,15.46) v1(29.38,4.14) v1(29.42,10.71) v1(29.53,12.79) v1(29.53,11.25) v1(29.66,15.45) v1(29.91,13.17) v1(29.92,11.62) v1(30.13,13.61) v1(30.3,11.99) v1(30.71,12.36) v1(30.96,14.49) v1(31.15,12.72) v1(31.29,14.82) v1(31.67,15.21) v1(31.67,13.01) v1(31.78,16.72) v1(31.77,1.44) v1(32,15.54) v1(32.06,13.34) v1(32.05,9.08) v1(32.39,13.72) v1(32.66,17.57) v1(32.66,16.91) v1(32.83,14.16) v1(33.05,16.47) v1(33.03,12.86) v1(33.08,4.41) v1(33.06,2.68) v1(33.05,1.01) v1(33.22,14.55) v1(33.54,18.4) v1(33.66,14.99) v1(33.94,13.75) v1(33.95,12.05) v1(34.11,18.7) v1(34.16,15.26) v1(34.34,5.71) v1(34.38,4.02) v1(34.35,2.28) v1(34.7,18.67) v1(34.7,15.04) v1(35.08,18.29) v1(35.19,13.28) v1(35.2,11.67) v1(35.25,15.32) v1(35.62,14.6) v1(35.64,6.95) v1(35.62,5.25) v1(35.63,3.53) v1(35.97,17.41) v1(36.02,16.2) v1(36.29,16.8) v1(36.44,12.86)
VDD-SPI: length 6.3
  Top Layer w0.15: v1(25.9,4.76) 25.9,5.95 U1.18
  Top Layer w0.4: v1(29.64,4.76) U9.8
  Top Layer w0.5: C16.1 C17.1
  Bottom Layer w0.15: v1(25.9,4.76) v1(29.64,4.76)
BAT: length 23.1
  Top Layer w0.4: 11.13,1.91 12.39,1.91 13.23,2.75 13.23,4.2 ; 11.13,1.91 11.16,1.88 11.16,0.78 ; 11.13,1.91 9.51,1.91 8.9,1.29 电池.2 ; 17.12,5.3 17.12,5.29 v2(17.12,4.22) 17.12,4.21 C14.2
  Top Layer w0.5: v2(19.32,3.83) 19.91,3.82 ; U5.3 13.06,4.2 ; v2(19.32,5.98) 19.91,6.13
  Bottom Layer w0.4: v2(19.32,3.83) 17.51,3.83 v2(17.12,4.22) 17.12,5.23 17.88,5.98 v2(19.32,5.98)
BAT-OUT: length 1.4
  Top Layer w0.5: 15.45,8.54 16.16,7.83 Q2.3
BCLK: length 4.2
  Top Layer w0.2: U8.C1 v1(26.35,14.35)
  Top Layer w0.28: v1(26.89,11.33) U1.5
  Bottom Layer w0.15: v1(26.35,14.35) 26.89,13.81 v1(26.89,11.33)
BOOT: length 13.8
  Top Layer w0.254: R12.2 NOREF#2.TP1 23.95,10.91 v1(24.22,10.65)
  Top Layer w0.28: U1.15 24.71,7.14 v1(24.31,7.14)
  Top Layer w0.4: v1(19.62,15.11) R16.1
  Bottom Layer w0.15: v1(24.31,7.14) 24.41,7.14 24.72,7.45 24.72,10.2 24.28,10.65 v1(24.22,10.65) 24.19,10.63 23.2,10.63 19.62,14.21 v1(19.62,15.11)
CHRG: length 34.4
  Top Layer w0.15: R19.2 v1(30.93,7.64) U1.27 ; U5.1 10.2,4.47 v1(8.38,2.64)
  Bottom Layer w0.15: v1(30.93,7.64) 31.78,6.78 31.78,3.43 30.03,1.68 23.81,1.68 22.98,0.84 10.18,0.84 v1(8.38,2.64)
D+: length 34.9
  Top Layer w0.15: 8.41,8.97 8.41,9.64 8.12,9.94 7.31,9.94 USB1.A6
  Top Layer w0.25: 8.41,8.95 USB1.B6 ; U1.26 v1(30.11,7.14)
  Bottom Layer w0.15: v1(30.11,7.14) 27.31,7.14 25.22,5.05 24.64,5.05 24.12,4.53 24.12,2.69 22.77,1.34 10.8,1.34 8.41,3.73 v1(8.41,8.95)
D-: length 35.3
  Top Layer w0.25: v1(8,10.45) 8,10.45 7.3,10.45 ; v1(8,9.44) 8,9.45 7.3,9.45 ; U1.25 30.1,6.64 v1(30.1,6.64)
  Bottom Layer w0.15: v1(8,10.45) v1(8,9.44) 8,3.59 10.5,1.09 22.87,1.09 24.37,2.59 24.37,4.42 24.74,4.8 25.35,4.8 27.19,6.64 v1(30.1,6.64)
DIN: length 4.1
  Top Layer w0.2: v1(25.84,14.35) U8.B1
  Top Layer w0.28: v1(25.39,11.33) 25.39,10.81 arc(25.39,10.81) U1.8
  Bottom Layer w0.15: v1(25.84,14.35) 25.39,13.9 v1(25.39,11.33)
EN: length 3
  Top Layer w0.2: 25.69,12.05 25.87,11.87 25.87,10.83 U1.7
  Top Layer w0.254: R9.1 25.67,12.83 NOREF.TP2
  Top Layer w0.5: 25.69,12.07 R9.1
FB: length 2.9
  Top Layer w0.3: U3.5 14.07,12.62 R2.1
  Top Layer w0.5: R3.1 C2.2 R2.1
INT1: length 19.3
  Top Layer w0.15: U2.4 23.57,0.89 23,1.45 23,2.39 22.59,2.8 22.59,5.7 v1(21.95,6.34)
  Top Layer w0.27: U1.16 v1(24.72,6.34)
  Bottom Layer w0.15: v1(24.72,6.34) 24.71,6.34 v1(21.95,6.34) 21.8,6.49 LCD1.11
IO0: length 5.4
  Top Layer w0.2: v1(26.81,15.55) 26.81,15.55 26.35,15.55
  Top Layer w0.28: v1(27.39,11.33) 27.39,10.81 arc(27.39,10.81) U1.4
  Bottom Layer w0.15: v1(26.81,15.55) 26.81,14.25 27.39,13.67 v1(27.39,11.33)
IO2: length 15
  Top Layer w0.15: v1(22.44,2.25) 22.09,1.9 U2.13
  Top Layer w0.2: U2.13 20.84,1.9 20.78,1.96
  Top Layer w0.25: U11.7 23.87,4.96 v1(23.47,4.96)
  Top Layer w0.28: v1(26.39,11.33) U1.6
  Bottom Layer w0.15: v1(26.39,11.33) 26.39,6.76 25.03,5.39 23.9,5.39 v1(23.47,4.96) 23.86,4.56 23.86,2.87 23.24,2.25 v1(22.44,2.25)
IO4: length 13
  Top Layer w0.28: U1.9 24.71,10.14 v1(24.22,10.14)
  Bottom Layer w0.15: v1(24.22,10.14) 24.2,10.15 23.66,10.15 22.8,9.29 12.1,9.29
IO5: length 13
  Top Layer w0.28: U1.10 24.22,9.64 v1(24.22,9.63)
  Bottom Layer w0.15: 12.1,8.59 22.74,8.59 23.77,9.63 v1(24.22,9.63)
IO6: length 12.9
  Top Layer w0.28: U1.12 24.23,8.64 v1(24.22,8.62)
  Bottom Layer w0.15: LCD1.9 22.64,7.89 23.38,8.63 24.21,8.63 v1(24.22,8.62)
IO7: length 13
  Top Layer w0.28: U1.13 24.23,8.14 v1(24.22,8.12)
  Bottom Layer w0.15: v1(24.22,8.12) 24.21,8.13 23.47,8.13 22.54,7.19 LCD1.10
IO8: length 13.9
  Top Layer w0.15: U2.14 22.25,1.4 v1(22.6,1.75)
  Top Layer w0.2: U2.14 21.64,1.4 21.43,1.19 20.78,1.19
  Top Layer w0.25: v1(24.17,7.62) 24.7,7.62 U1.14 ; v1(23.75,5.8) 23.75,5.58 U11.8
  Bottom Layer w0.15: v1(22.6,1.75) 22.5,1.84 22.27,1.84 22.03,2.08 22.03,2.42 22.27,2.65 23.29,2.65 23.61,2.97 23.61,4.19 23.05,4.75 23.05,5.51 23.34,5.8 v1(23.75,5.8) 24.96,5.8 25.22,6.06 25.22,6.62 25.06,6.78 24.52,6.78 24.47,6.73 24.14,6.73 23.9,6.97 23.9,7.41 24.12,7.62 v1(24.17,7.62)
IO21: length 39.4
  Top Layer w0.15: v1(7.91,3.11) 7.91,3.56 11.16,6.81 U5.5 ; U1.28 v1(31.53,8.14) R18.2
  Bottom Layer w0.15: v1(31.53,8.14) 32.04,7.63 32.04,3.32 30.14,1.43 23.92,1.43 23.08,0.59 10.08,0.59 8.47,2.19 8.23,2.19 7.91,2.51 v1(7.91,3.11)
KEY: length 14.9
  Top Layer w0.4: v1(9.61,3.23) 10.2,3.23 arc(10.2,3.23) U4.3 ; 8.35,16.99 8.35,16.12 arc(8.35,16.12) v1(8.34,16.12)
  Bottom Layer w0.15: v1(8.34,16.12) 8.34,10.93 8.82,10.45 8.82,4.02 v1(9.61,3.23)
OUT: length 9.2
  Top Layer w0.5: U3.4 12.87,13.32 arc(13.12,13.7) U3.1 ; U3.4 D1.1 14.1,10.25 Q1.3 ; U3.4 11.24,11.69 9.45,11.69
SPICLK: length 6.1
  Top Layer w0.15: U1.22 27.89,2.24 v1(27.88,2.23)
  Top Layer w0.254: 30.22,2.24 U9.6
  Top Layer w0.4: v1(29.64,2.24) 30.22,2.24
  Bottom Layer w0.15: v1(27.88,2.23) 29.62,2.23 v1(29.64,2.24)
SPICS0: length 4.6
  Top Layer w0.15: U1.21 27.39,4.33 v1(27.38,4.32)
  Top Layer w0.4: v1(24.85,4.32) U9.1
  Bottom Layer w0.15: v1(27.38,4.32) v1(24.85,4.32)
SPID: length 6.9
  Top Layer w0.15: U1.23 28.39,0.98 v1(28.38,0.96)
  Top Layer w0.254: 30.23,0.97 U9.5
  Top Layer w0.4: v1(29.64,0.97) 30.23,0.97
  Bottom Layer w0.15: v1(28.38,0.96) 29.63,0.96 v1(29.64,0.97)
SPIHD: length 6.3
  Top Layer w0.15: U1.19 v1(26.39,3.5)
  Top Layer w0.4: v1(29.64,3.51) 30.23,3.51
  Bottom Layer w0.15: v1(26.39,3.5) 29.63,3.5 v1(29.64,3.51)
SPIQ: length 7.5
  Top Layer w0.15: U1.24 28.89,3.03 v1(28.92,3)
  Top Layer w0.4: v1(24.85,3.05) U9.2
  Bottom Layer w0.15: v1(28.92,3) 28.87,3.05 v1(24.85,3.05)
SPIWQ: length 5.5
  Top Layer w0.15: 24.89,2.23 U9.3 24.89,2.23 ; 24.89,2.23 26.39,2.23 26.89,2.73 U1.20
X-N: length 5.1
  Top Layer w0.15: X1.3 34.44,8.25 32.51,8.25 C18.1 32.11,8.64 U1.29
X-P: length 2.8
  Top Layer w0.15: U1.30 31.04,9.14 R8.2
$1N1912: length 3.2
  Top Layer w0.5: U3.3 11.3,14.16 11.3,15.33 10.37,16.26 10.37,16.97
$1N3352: length 4.5
  Top Layer w0.15: 31.05,13.53 31.7,14.19
  Top Layer w0.154: U1.1 28.89,11.37 31.05,13.53
$1N3356: length 2.2
  Top Layer w0.2: U1.2 28.39,12.09 28.26,12.23
  Top Layer w0.5: 28.26,12.84 28.26,12.07
$1N5412: length 1
  Top Layer w0.2: 25.95,15.55 25.59,16.54
$1N5450: length 1.3
  Top Layer w0.2: R6.1 25,16.17 arc(25.05,16.09) 25.13,16.03 25.55,15.55
$1N6310: length 6.2
  Top Layer w0.4: R6.2 23.82,17.52 arc(24,17.97) 24.46,18.16 喇叭.2
$1N6314: length 5.7
  Top Layer w0.4: R5.2 30.16,16.53 arc(30.5,16.67) 30.63,17 喇叭.1
$1N6617: length 1
  Top Layer w0.5: R7.1 U5.6
$1N6831: length 4
  Top Layer w0.4: U4.1 12.59,3.23 v1(12.59,3.23) ; Q2.1 15.2,5.29 v1(14.73,5.29)
  Bottom Layer w0.3: v1(12.59,3.23) 12.67,3.23 v1(14.73,5.29)
$1N8218: length 2.6
  Top Layer w0.15: 34.64,9.95 34.45,9.76 33.46,9.76 C19.2 33.06,10.11 32.56,10.61 R8.1
$1N8890: length 2.3
  Top Layer w0.154: R4.2 33.93,16.36
$1N9299: length 3.7
  Top Layer w0.4: Q3.3 21.47,17.45 19.25,17.45 18.86,17.05 R15.1
$1N9303: length 7.8
  Top Layer w0.4: v1(18.35,15.59) 18.83,15.59 arc(18.85,15.59) R15.2
  Bottom Layer w0.254: 12.1,12.79 14.5,12.79 arc(15.48,12.98) 16.3,13.53 v1(18.35,15.59)
$1N9342: length 2.3
  Top Layer w0.4: R16.2 20.32,16.47 20.78,16 20.78,15.11 Q3.1
$1N23263: length 2.3
  Top Layer w0.254: 20.78,6.13 20.78,5.36 21.39,5.36 21.8,4.95 U11.2
$1N23275: length 2.1
  Top Layer w0.254: 20.78,3.82 20.78,4.59 20.92,4.45 U11.3

## Copper pours and planes (outline as drawn; the poured copper is in the pictures)
3V3 on Top Layer: 13.28,18.04 26.86,18.04 26.86,0.92 13.28,0.92
3V3 on Top Layer: 29.27,11.53 31.79,11.53 31.79,9.5 29.27,9.5
3V3 on Top Layer: 31.63,7.48 32.95,7.48 32.95,6.16 31.63,6.16
5V on Top Layer: 13.24,8.99 13.84,8.99 13.84,6.95 13.24,6.95
5V on Top Layer: 8.78,10.25 9.58,10.25 9.58,8.71 8.78,8.71
GND on Top Layer: -1.45,20.79 37.77,20.79 37.77,-2.12 -1.45,-2.12
GND on Bottom Layer: -0.7,21.54 38.52,21.54 38.52,-1.37 -0.7,-1.37

Small or netless copper shapes (teardrops, artwork), in the pictures only: 325 on Top Layer, 72 on Bottom Layer

## Text on the board
Bottom Silkscreen Layer: Designed by CoCandy | 2025/10  V1.1.3
Document Layer: BeaconOps | 直接打样即可
Top Silkscreen Layer: ESP32C3
